# Altium schematic sheet AD9236.SchDoc
size A4; SheetNumber: 17; SheetTotal: 33
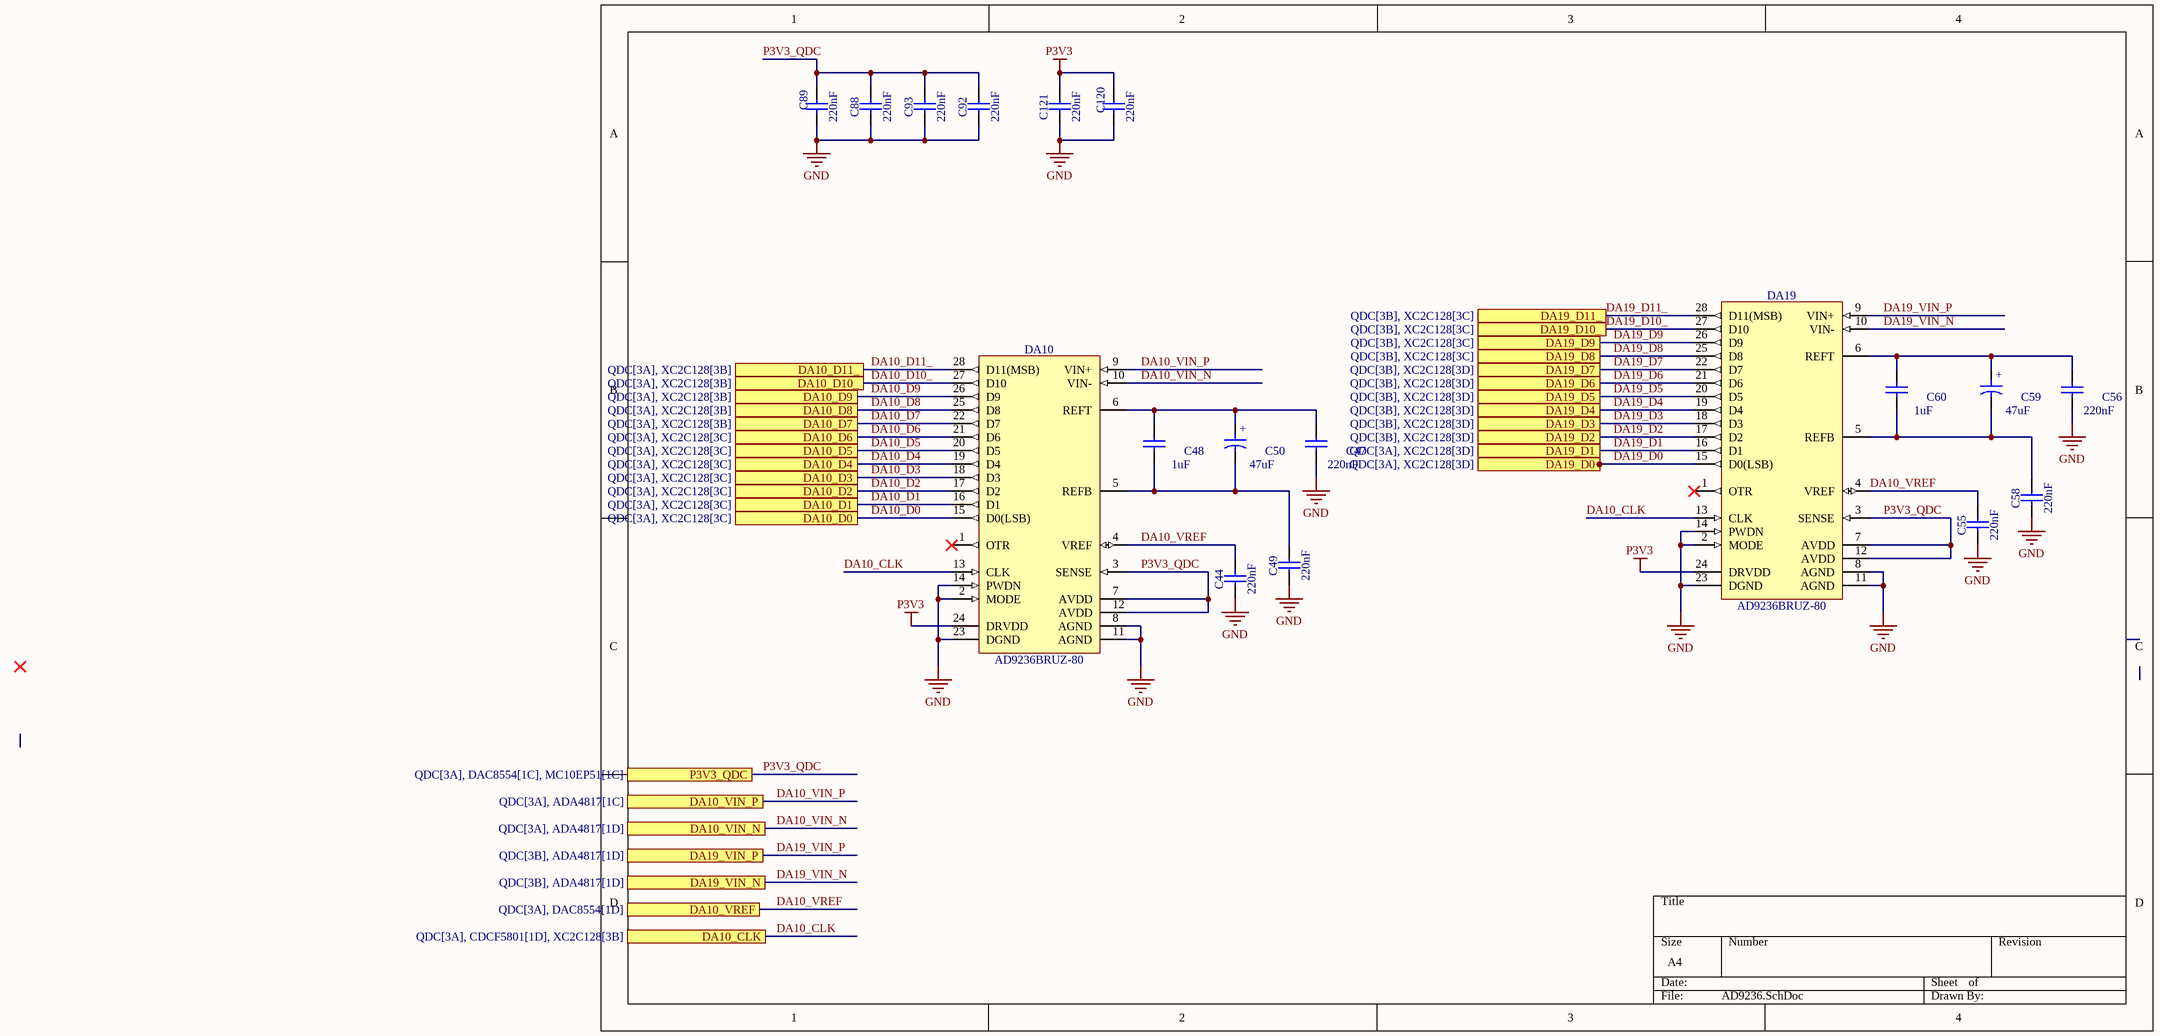
[diagram p0: AD9236.SchDoc]

## Parts
C44  220nF  [CAPC2012X135N]
C47  220nF  [CAPC2012X135N]
C48  1uF  [CAPC2012X140N]
C49  220nF  [CAPC2012X135N]
C50  47uF  [CAPMP3528X120N]
C55  220nF  [CAPC2012X135N]
C56  220nF  [CAPC2012X135N]
C58  220nF  [CAPC2012X135N]
C59  47uF  [CAPMP3528X120N]
C60  1uF  [CAPC2012X140N]
C88  220nF  [CAPC2012X135N]
C89  220nF  [CAPC2012X135N]
C92  220nF  [CAPC2012X135N]
C93  220nF  [CAPC2012X135N]
C120  220nF  [CAPC2012X135N]
C121  220nF  [CAPC2012X135N]
DA10  AD9236BRUZ-80  [SOP65P640X120-28N]
DA19  AD9236BRUZ-80  [SOP65P640X120-28N]

## Ports
DA10_CLK (see QDC[3A], CDCF5801[1D], XC2C128[3B]), DA10_D0 (see QDC[3A], XC2C128[3C]), DA10_D1 (see QDC[3A], XC2C128[3C]), DA10_D2 (see QDC[3A], XC2C128[3C]), DA10_D3 (see QDC[3A], XC2C128[3C]), DA10_D4 (see QDC[3A], XC2C128[3C]), DA10_D5 (see QDC[3A], XC2C128[3C]), DA10_D6 (see QDC[3A], XC2C128[3C]), DA10_D7 (see QDC[3A], XC2C128[3B]), DA10_D8 (see QDC[3A], XC2C128[3B]), DA10_D9 (see QDC[3A], XC2C128[3B]), DA10_D10_ (see QDC[3A], XC2C128[3B]), DA10_D11_ (see QDC[3A], XC2C128[3B]), DA10_VIN_N (see QDC[3A], ADA4817[1D]), DA10_VIN_P (see QDC[3A], ADA4817[1C]), DA10_VREF (see QDC[3A], DAC8554[1D]), DA19_D0 (see QDC[3A], XC2C128[3D]), DA19_D1 (see QDC[3A], XC2C128[3D]), DA19_D2 (see QDC[3B], XC2C128[3D]), DA19_D3 (see QDC[3B], XC2C128[3D]), DA19_D4 (see QDC[3B], XC2C128[3D]), DA19_D5 (see QDC[3B], XC2C128[3D]), DA19_D6 (see QDC[3B], XC2C128[3D]), DA19_D7 (see QDC[3B], XC2C128[3D]), DA19_D8 (see QDC[3B], XC2C128[3C]), DA19_D9 (see QDC[3B], XC2C128[3C]), DA19_D10_ (see QDC[3B], XC2C128[3C]), DA19_D11_ (see QDC[3B], XC2C128[3C]), DA19_VIN_N (see QDC[3B], ADA4817[1D]), DA19_VIN_P (see QDC[3B], ADA4817[1D]), P3V3_QDC (see QDC[3A], DAC8554[1C], MC10EP51[1C])

## Nets
GND: C44.1 C47.1 C49.1 C55.1 C56.1 C58.1 C88.1 C89.1 C92.1 C93.1 C120.1 C121.1 DA10.2(MODE) DA10.8(AGND) DA10.11(AGND) DA10.14(PWDN) DA10.23(DGND) DA19.2(MODE) DA19.8(AGND) DA19.11(AGND) DA19.14(PWDN) DA19.23(DGND)
P3V3: C120.2 C121.2 DA10.24(DRVDD) DA19.24(DRVDD)
DA10_CLK: DA10.13(CLK) DA19.13(CLK) ; port DA10_CLK
DA10_D0: DA10.15(D0(LSB)) ; port DA10_D0
DA10_D1: DA10.16(D1) ; port DA10_D1
DA10_D2: DA10.17(D2) ; port DA10_D2
DA10_D3: DA10.18(D3) ; port DA10_D3
DA10_D4: DA10.19(D4) ; port DA10_D4
DA10_D5: DA10.20(D5) ; port DA10_D5
DA10_D6: DA10.21(D6) ; port DA10_D6
DA10_D7: DA10.22(D7) ; port DA10_D7
DA10_D8: DA10.25(D8) ; port DA10_D8
DA10_D9: DA10.26(D9) ; port DA10_D9
DA10_D10_: DA10.27(D10) ; port DA10_D10_
DA10_D11_: DA10.28(D11(MSB)) ; port DA10_D11_
DA10_VIN_N: DA10.10(VIN-) ; port DA10_VIN_N
DA10_VIN_P: DA10.9(VIN+) ; port DA10_VIN_P
DA10_VREF: C44.2 C55.2 DA10.4(VREF) DA19.4(VREF) ; port DA10_VREF
DA19_D0: DA19.15(D0(LSB)) ; port DA19_D0
DA19_D1: DA19.16(D1) ; port DA19_D1
DA19_D2: DA19.17(D2) ; port DA19_D2
DA19_D3: DA19.18(D3) ; port DA19_D3
DA19_D4: DA19.19(D4) ; port DA19_D4
DA19_D5: DA19.20(D5) ; port DA19_D5
DA19_D6: DA19.21(D6) ; port DA19_D6
DA19_D7: DA19.22(D7) ; port DA19_D7
DA19_D8: DA19.25(D8) ; port DA19_D8
DA19_D9: DA19.26(D9) ; port DA19_D9
DA19_D10_: DA19.27(D10) ; port DA19_D10_
DA19_D11_: DA19.28(D11(MSB)) ; port DA19_D11_
DA19_VIN_N: DA19.10(VIN-) ; port DA19_VIN_N
DA19_VIN_P: DA19.9(VIN+) ; port DA19_VIN_P
P3V3_QDC: C88.2 C89.2 C92.2 C93.2 DA10.3(SENSE) DA10.7(AVDD) DA10.12(AVDD) DA19.3(SENSE) DA19.7(AVDD) DA19.12(AVDD) ; port P3V3_QDC
NetC47_2: C47.2 C48.2 C50.1 DA10.6(REFT)
NetC48_1: C48.1 C49.2 C50.2 DA10.5(REFB)
NetC56_2: C56.2 C59.1 C60.2 DA19.6(REFT)
NetC58_2: C58.2 C59.2 C60.1 DA19.5(REFB)

Not connected (* = marked no-connect by the designer): DA10 1(OTR)*; DA19 1(OTR)*

## Notes on the sheet
- (in symbol CTE3528-12_47UF_10V_20%_PANASONIC_TPG) +

## Library data of the parts
C44 C47 C49 C55 C56 C58 C88 C89 C92 C93 C120 C121 = CC0805_220NF_50V_10%_X7R: Non-polarised capacitor; Part Description: SMD Multilayer Chip Ceramic Capacitor; Manufacturer: GENERIC; Manufacturer1 Part Number: GRM21BR71H224KA01L; Voltage: 50V; TC: X7R; Tolerance: ±10%; Part Number: CC0805_220NF_50V_10%_X7R; Component Kind: Standard; Component Type: Standard; Pin Count: 2; Value: 220nF; Status: Preferred; Manufacturer Part Number: CC0805_220NF_50V_10%_X7R; Case: 0805; Mounted: Yes; Socket: No; SMD: Yes; Sense: No; Manufacturer1 Example: MURATA; Manufacturer1 ComponentHeight: 1.35mm; HelpURL: \\cern.ch\dfs\Applications\Altium\Datasheets\CC0805_X7R_MURATA.pdf; Author: CERN DEM JLC; CreateDate: 03.12.2007; LatestRevisionDate: 03.12.2007
C48 C60 = CC0805_1UF_25V_10%_X7R: Non-polarised capacitor; Part Description: SMD Multilayer Chip Ceramic Capacitor; Manufacturer: GENERIC; Manufacturer1 Part Number: C0805C105K3RAC; Voltage: 25V; TC: X7R; Tolerance: ±10%; Part Number: CC0805_1UF_25V_10%_X7R; Component Kind: Standard; Component Type: Standard; Pin Count: 2; Value: 1uF; Status: Preferred; Manufacturer Part Number: CC0805_1UF_25V_10%_X7R; Case: 0805; Mounted: Yes; Socket: No; SMD: Yes; Sense: No; Manufacturer1 Example: KEMET; Manufacturer1 ComponentHeight: 1.4mm; HelpURL: \\cern.ch\dfs\Applications\Altium\Datasheets\CC0805_X7R_KEMET.pdf; Author: CERN DEM JLC; CreateDate: 23.03.2009; LatestRevisionDate: 23.03.2009
C50 C59 = CTE3528-12_47UF_10V_20%_PANASONIC_TPG: Polarised capacitor; Part Description: ESR 0R07 Solid Tantalum Chip Capacitor; Manufacturer Part Number: 10TPG47M; Voltage: 10V; Tolerance: ±20%; Part Number: CTE3528-12_47UF_10V_20%_PANASONIC_TPG; Component Kind: Standard; Component Type: Standard; Pin Count: 2; Value: 47uF; Status: None; Manufacturer: PANASONIC; Case: T; Mounted: Yes; Socket: No; SMD: Yes; Sense: No; ComponentHeight: 1.2mm; HelpURL: \\cern.ch\dfs\Applications\Altium\Datasheets\CTE_PANASONIC_TPG.pdf; Author: CERN DEM JLC; CreateDate: 01.09.2014; LatestRevisionDate: 01.09.2014
DA10 DA19 = AD9236BRUZ-80: 12-Bit, 80 MSPS 3 V ADC; Part Description: 12-Bit, 40 MSPS, 3V Analog-to-Digital Converter; Manufacturer: ANALOG DEVICES; Manufacturer Part Number: AD9235BRUZ-40; PressFit: No; Bonding: No; Part Number: AD9236BRUZ-80; Component Kind: Standard; Component Type: Standard; Device: AD9236BRUZ-80; PackageDescription: SOP, 0.65mm Pitch; 28 Pin, 4.40mm W X 9.70mm L X 1.20mm H body, IPC Medium Density; Pin Count: 28; Case: TSSOP28; Mounted: Yes; Socket: No; SMD: Yes; Sense: No; ComponentHeight: 1.2mm; Author: CERN DEM HF; HelpURL: \\cern.ch\dfs\Applications\Altium\Datasheets\AD9236BRUZ-80.pdf; CreateDate: 06.05.2024; LatestRevisionDate: 06.05.2024